# Altium schematic sheet Master_MCU.SchDoc
size A4; Organization: Altium Limited; Address1: L3, 12a Rodborough Rd; Address2: Frenchs Forest; Address3: NSW; Address4: Australia 2086
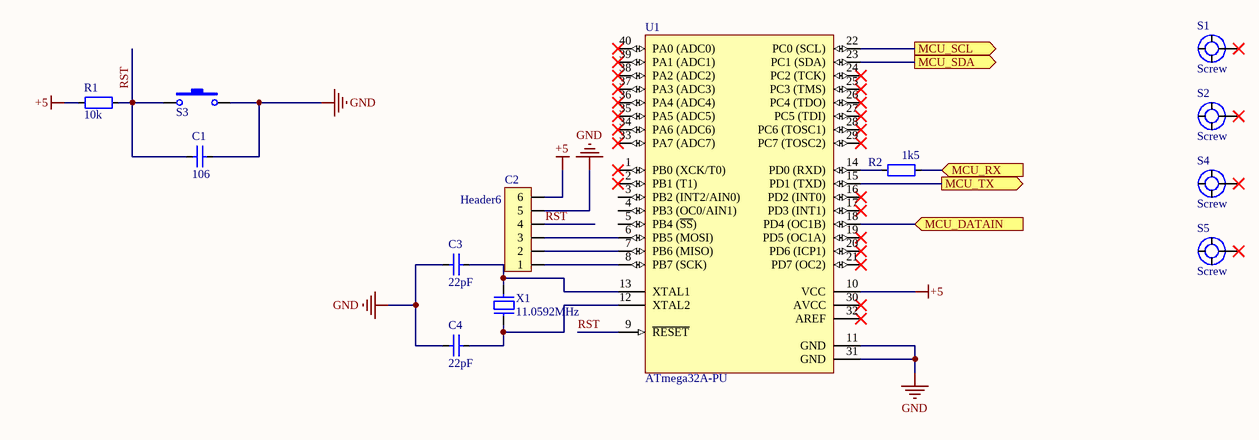
[diagram p0: Master_MCU.SchDoc]

## Parts
C1  106  [CAP_0805]
C2  Header6  [JP6H]
C3  22pF  [CAP_0805]
C4  22pF  [CAP_0805]
R1  10k  [RES-SMD-0805]
R2  1k5  [RES-SMD-0805]
S1  Screw  [Screw 3 small]
S2  Screw  [Screw 3 small]
S3  SW-SMD  [SW 3x2x4]  (value not drawn)
S4  Screw  [Screw 3 small]
S5  Screw  [Screw 3 small]
U1  ATmega32A-PU  [DIP40/W0.6]
X1  11.0592MHz  [XT2]

## Ports
MCU_DATAIN (in), MCU_RX (in), MCU_SCL (out), MCU_SDA (out), MCU_TX (out)

## Nets
+5: C2.6 R1.1 U1.10(VCC)
GND: C1.2 C2.5 C3.1 C4.1 S3.2 U1.11(GND) U1.31(GND)
MCU_DATAIN: U1.18(PD4_(OC1B)) ; port MCU_DATAIN
MCU_RX: R2.2 ; port MCU_RX
MCU_SCL: U1.22(PC0_(SCL)) ; port MCU_SCL
MCU_SDA: U1.23(PC1_(SDA)) ; port MCU_SDA
MCU_TX: U1.15(PD1_(TXD)) ; port MCU_TX
RST: C1.1 C2.4 R1.2 S3.1 U1.9(~{RESET})
NetC2_1: C2.1 U1.8(PB7_(SCK))
NetC2_2: C2.2 U1.7(PB6_(MISO))
NetC2_3: C2.3 U1.6(PB5_(MOSI))
NetC3_2: C3.2 U1.13(XTAL1) X1.2
NetC4_2: C4.2 U1.12(XTAL2) X1.1
NetR2_1: R2.1 U1.14(PD0_(RXD))

Not connected (* = marked no-connect by the designer): S1 1*; S2 1*; S4 1*; S5 1*; U1 1(PB0_(XCK/T0))* 2(PB1_(T1))* 3(PB2_(INT2/AIN0)) 4(PB3_(OC0/AIN1)) 5(PB4_(~{SS})) 16(PD2_(INT0))* 17(PD3_(INT1))* 19(PD5_(OC1A))* 20(PD6_(ICP1))* 21(PD7_(OC2))* 24(PC2_(TCK))* 25(PC3_(TMS))* 26(PC4_(TDO))* 27(PC5_(TDI))* 28(PC6_(TOSC1))* 29(PC7_(TOSC2))* 30(AVCC)* 32(AREF)* 33(PA7_(ADC7))* 34(PA6_(ADC6))* 35(PA5_(ADC5))* 36(PA4_(ADC4))* 37(PA3_(ADC3))* 38(PA2_(ADC2))* 39(PA1_(ADC1))* 40(PA0_(ADC0))*

## Notes on the sheet
- Labels drawn without touching a wire or pin: Page Contents:, Project:
- Size:
- Date:
- A4
- Ver:
- Time:
- Author:
- Checked by:
- File:

## Library data of the parts
C1 C3 C4 = CapSMD: Capacitor; Value: 33p; Published: 8-Jun-2000; LatestRevisionDate: 17-Jul-2002; LatestRevisionNote: Re-released for DXP Platform.; PackageReference: RAD-0.3; Publisher: Altium Limited
C2 = Header6: Header IDC, 6 x 1 Pin Vertical 2.54mm Pitch (Non-Boxed, Male); Manufacturer: W¨¹rth Elektronik eiSos GmbH; partNo: 613002143121; ComponentLink1 Description: Manufacturer; ComponentLink2 Description: Datasheet; NoPins: 02; Created Date: 29 March 2013; ComponentLink1URL: http://www.we-online.com; ComponentLink2URL: http://katalog.we-online.de/em/datasheet/6130xx143121.pdf; Created by: Karrer Zheng
R1 R2 = Resistor - SMD: Resistor; Manufacturer: Generic Components; Class: Passive; Published: 08/06/2000; Publisher: Altium Hobart Technology Centre
S3 = SW-SMD: Switch; Published: 24-Mar-1999; LatestRevisionDate: 17-Jul-2002; LatestRevisionNote: Re-released for DXP Platform.; PackageReference: SPST-2; Publisher: Altium Limited
U1 = ATmega32A-PU: 8-Bit AVR Microcontroller with 32K Bytes of In-System Programmable Flash Memory; Published: 17-Sep-2003; DatasheetVersion: 2503C-AVR-10/02; PackageVersion: revB, Sep-2001; PackageReference: 40P6; Publisher: Altium Limited; PackageDescription: 40-lead (0.600"/15.24mm Wide) Plastic Dual Inline Package (PDIP); Supplier 1: Digi-Key; Supplier Part Number 1: ATMEGA32-16PC-ND; Supplier 2: Mouser; Supplier Part Number 2: 556-ATMEGA32-16PC; Code_JEDEC: MS-011-AC; ComponentLink1Description: Datasheet; ComponentLink1URL: http://www.atmel.com/dyn/resources/prod_documents/doc2503.pdf; ComponentLink2Description: Atmel.com Home; ComponentLink2URL: http://www.atmel.com
X1 = XT2: Crystal For all Crystal 2pin.; Value: 4Mhz